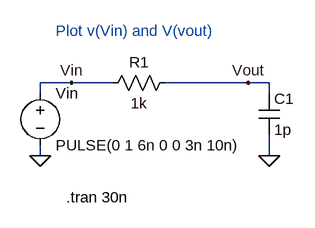
[diagram p0: schematic Fig1_27_old.asc]
Fig1_27_old.asc, the LTspice schematic file:
Version 4
SHEET 1 1048 680
WIRE 0 240 0 224
WIRE 0 336 0 320
WIRE 48 224 0 224
WIRE 112 224 48 224
WIRE 320 224 192 224
WIRE 352 224 320 224
WIRE 352 240 352 224
WIRE 352 336 352 304
FLAG 0 336 0
FLAG 352 336 0
FLAG 320 224 Vout
FLAG 48 224 Vin
SYMBOL voltage 0 224 R0
WINDOW 123 0 0 Left 0
WINDOW 39 0 0 Left 0
SYMATTR InstName Vin
SYMATTR Value PULSE(0 1 6n 0 0 3n 10n)
SYMBOL res 96 240 R270
WINDOW 0 32 56 VTop 0
WINDOW 3 0 56 VBottom 0
SYMATTR InstName R1
SYMATTR Value 1k
SYMBOL cap 336 240 R0
SYMATTR InstName C1
SYMATTR Value 1p
TEXT 40 400 Left 0 !.tran 30n
TEXT 24 144 Left 0 ;Plot v(Vin) and V(vout)

The netlist it stands for:
* Fig1_27_old.asc
Vin Vin 0 PULSE(0 1 6n 0 0 3n 10n)
R1 Vin Vout 1k
C1 Vout 0 1p
.tran 30n
* Plot v(Vin) and V(vout)
.backanno
.end